# EAGLE design untitled 3 (EAGLE 7.5.0)
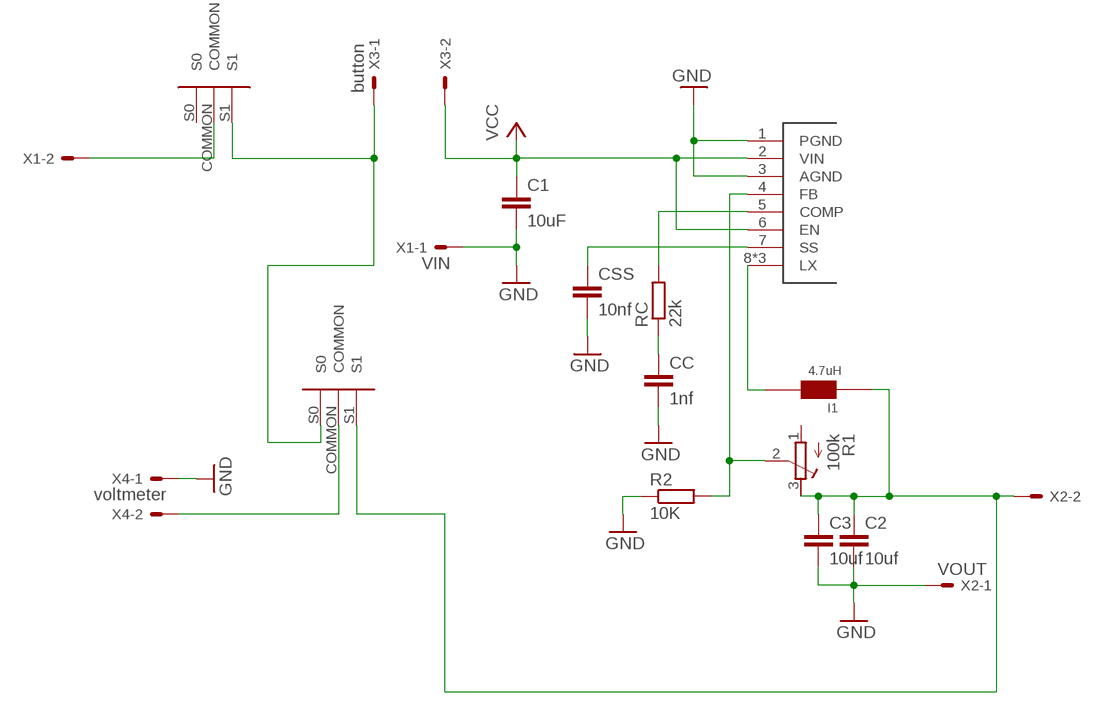
[diagram p0: schematic, sheet 1]

## Parts
C1  10uF  C-EUC0805K  [C0805K]
C2  10uf  C-EUC0805K  [C0805K]
C3  10uf  C-EUC0805K  [C0805K]
CC  1nf  C-EUC1206K  [C1206K]
CSS  10nf  C-EUC1206K  [C1206K]
I1  4.7uH  RH127  [RH127]
MASTER_ON  SPDT_SLIDE_SWITCH_2_PITCH  [SPDT_SLIDE_SWITCH_2_PITCH]
METER_SWITCH  SPDT_SLIDE_SWITCH_2_PITCH  [SPDT_SLIDE_SWITCH_2_PITCH]
R1  100k  R-TRIMM64W  [RTRIM64W]
R2  10K  R-EU_R1206  [R1206]
RC  22k  R-EU_R1206  [R1206]
U$3  AOZ1051PI  [AOZ1051PI]
X1  VIN  XH2.54  [XH2.54]
X2  VOUT  XH2.54  [XH2.54]
X3  button  XH2.54  [XH2.54]
X4  voltmeter  XH2.54  [XH2.54]

## Nets
GND: C1.2 C2.2 C3.2 CC.2 CSS.2 R2.1 U$3.1(PGND) U$3.3(AGND) X1.1 X2.1 X4.1
N$1: RC.2 U$3.5(COMP)
N$2: CC.1 RC.1
N$3: R1.2(S) R2.2 U$3.4(FB)
N$4: CSS.1 U$3.7(SS)
N$5: METER_SWITCH.COMMON X4.2
N$6: I1.P$1 U$3.8(LX) U$3.P$1(LX) U$3.P$2(LX)
N$7: C2.1 C3.1 I1.P$2 METER_SWITCH.S1 R1.3(E) X2.2
N$8: MASTER_ON.COMMON X1.2
N$10: MASTER_ON.S1 METER_SWITCH.S0 X3.1
VCC: C1.1 U$3.2(VIN) U$3.6(EN) X3.2
Unconnected: MASTER_ON.S0 R1.1(A)

## Library data of the parts
C1-C3 CC CSS = resistor:C-EU: CAPACITOR, European symbol
I1 = sh4dov lib:RH127
MASTER_ON METER_SWITCH = sh4dov lib:SPDT_SLIDE_SWITCH_2_PITCH
R1 = resistor:R-TRIMM: Trimm resistor
R2 RC = resistor:R-EU_: RESISTOR, European symbol
U$3 = sh4dov lib:AOZ1051PI
X1-X4 = sh4dov lib:XH2.54: .100" (2.54mm) Center Header - 2 Pin; MF: MOLEX; MPN: 22-23-2021; OC_FARNELL: 1462926; OC_NEWARK: 25C3832

## Board
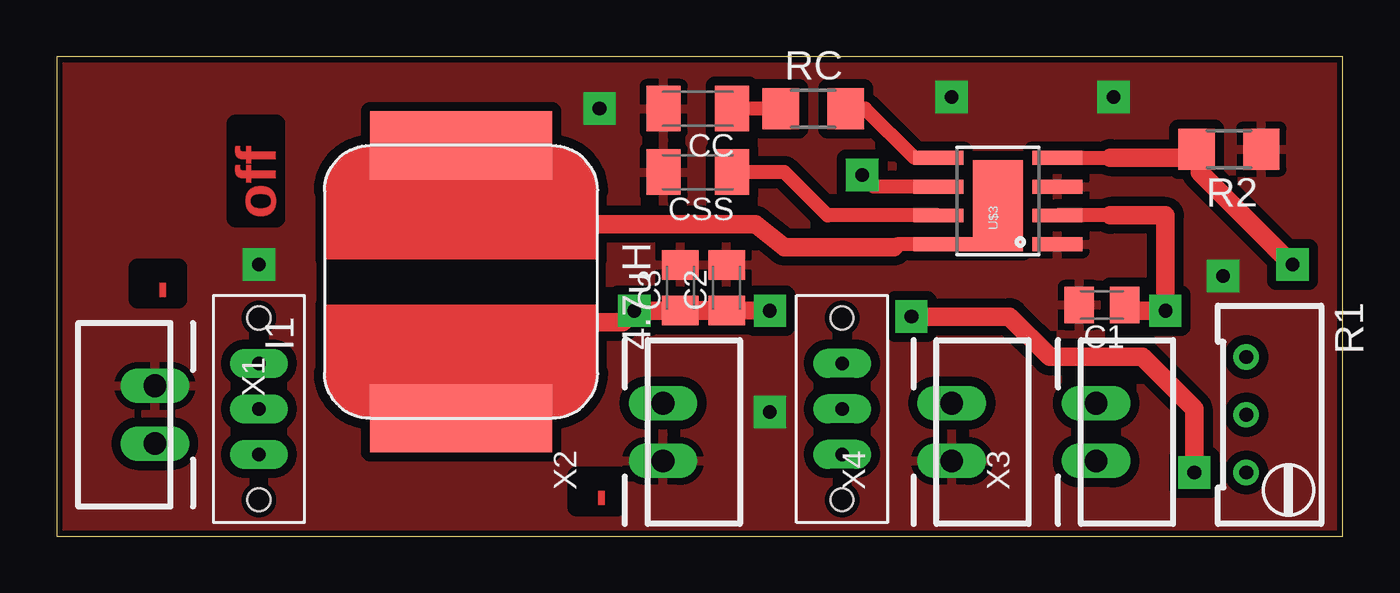
[diagram p1: board, top side]
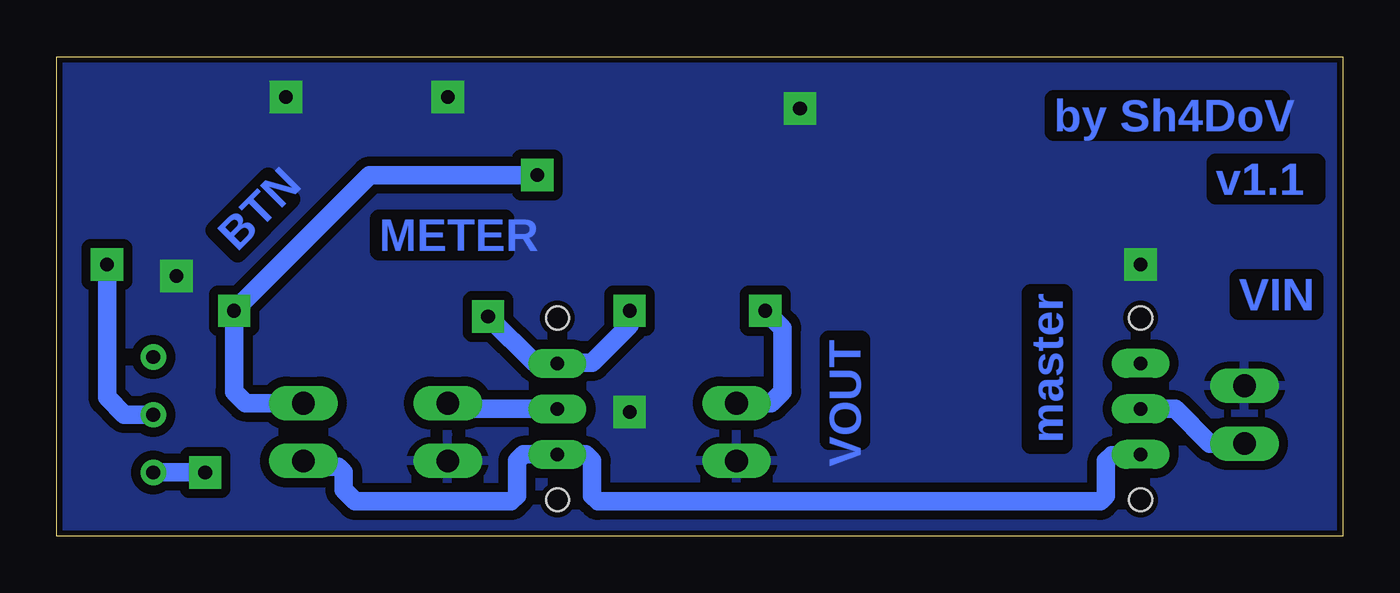
[diagram p2: board, bottom side, seen from below]

Size 56.57 x 21.07 mm. Coordinates in mm from the lower left corner, seen from the top.
Outline: 0,0 56.57,0 56.57,21.07 0,21.07 0,0
Copper layers (1*16): Top 0.035mm / dielectric 1.5mm / Bottom 0.035mm
Design rules "default 16mils": minimum track width 10mil, minimum drill 24mil, track to track 16mil, track to pad 16mil, pad to pad 16mil, via to via 16mil, smd to smd 10mil, copper to edge 10mil, drill to drill 10mil, minimum pad ring 10mil, minimum via ring 8mil, stop-mask expansion 4mil, vias tented up to drill 0mil, thermal gap 12mil

### Footprints (pad centres in the part's own frame; a part is rotated, then mirrored left to right if it is on the bottom)
C0805K = smd 1.3 x 1.6: 1 -1,0; 2 1,0
C1206K = smd 1.5 x 2: 1 -1.5,0; 2 1.5,0
RH127 = smd 8 x 3: P$1 0,6; P$2 0,-6
SPDT_SLIDE_SWITCH_2_PITCH = drill 0.6 pad 1.27 long: COMMON 0,0; S0 -2,0; S1 2,0 | hole 1: -4,0; 4,0
RTRIM64W = drill 0.61: 1 1.27,-2.54; 2 1.27,0; 3 1.27,2.54
R1206 = smd 1.6 x 1.803: 1 -1.422,0; 2 1.422,0
AOZ1051PI = smd 0.61 x 2.21: 1 -1.905,-2.616; 2 -0.635,-2.616; 3 0.635,-2.616; 4 1.905,-2.616; 5 1.905,2.616; 6 0.635,2.616; 7 -0.635,2.616; 8 -1.905,2.616 | smd 4 x 2.2: P$1 -0.2,0 | smd 0.6 x 0.6: P$2 -1.9,1.3
XH2.54 = drill 1 long: 1 -1.27,0; 2 1.27,0

### Placement (x,y rotation side)
C1  45.97,10.16 180 top
C2  29.46,10.92 90 top
C3  27.43,10.92 90 top
CC  28.19,18.8 180 top
CSS  28.19,16 180 top
I1  17.78,11.18 0 top
MASTER_ON  8.89,5.59 270 top
METER_SWITCH  34.54,5.59 90 top
R1  53.59,5.33 180 top
R2  51.56,17.02 180 top
RC  33.27,18.8 0 top
U$3  41.4,14.73 90 top
X1  4.32,5.33 270 top
X2  26.67,4.57 90 top
X3  45.72,4.57 90 top
X4  39.37,4.57 90 top

### Tracks (layer width: path | path; a pad name or v marks a point on that pad's centre or on a via)
GND  (via drill 0.6 pad 1.42)
  other vias: 23.88,18.8 8.89,11.94 31.37,5.46 51.31,11.43 39.37,19.3 46.48,19.3
  pour Bottom: 0,0 56.64,0 56.64,21.08 0,21.08
  pour Top: 0,21.08 56.64,21.08 56.64,0 0,0
N$1
  Top 0.61: U$3.5 37.72,16.64 35.56,18.8 RC.2
N$2
  Top 0.61: RC.1 CC.1
N$3  (via drill 0.6 pad 1.42)
  Top 0.61: U$3.4 46.35,16.64
  Top 0.813: v54.36,11.94 50.29,16 50.29,16.51 | 50.29,16.51 50.29,16.87 R2.2 | 46.35,16.64 50.16,16.64 50.29,16.51
  Bottom 0.813: R1.2 53.59,5.33 54.36,6.1 v54.36,11.94
N$4
  Top 0.61: CSS.1 32,16 33.91,14.1 U$3.7
N$5
  Bottom 0.813: METER_SWITCH.COMMON 39.12,5.59 X4.2
N$6
  Top 0.61: 20.83,18.03 17.88,18.03 I1.P$1 | U$3.P$1 40.64,15.04 40.64,12.95 40.52,12.83 U$3.P$2 U$3.8 36.96,12.83 36.83,12.7
  Top 0.813: 20.83,18.03 20.83,16.26 23.37,13.72 30.73,13.72 32,12.7 36.83,12.7
N$7  (via drill 0.6 pad 1.42)
  Top 0.813: I1.P$2 18.38,4.83 18.8,4.83 23.37,9.4 24.89,9.4 v25.4,9.91 28.69,9.91 C2.1 | C3.1 C2.1 | C2.1 29.07,9.92 v31.37,9.91 | v37.59,9.65 41.91,9.65 43.69,7.87 47.75,7.87 50.04,5.59 v50.04,2.79
  Bottom 0.813: X2.2 25.15,5.84 24.64,6.35 24.64,9.14 v25.4,9.91 | v37.59,9.65 35.53,7.59 METER_SWITCH.S1 34.51,7.62 33.02,7.62 31.37,9.27 v31.37,9.91 | v50.04,2.79 R1.3
N$8
  Bottom 0.813: X1.2 5.84,4.06 7.37,5.59 MASTER_ON.COMMON
N$9
  pour Bottom: 0,0 56.64,0 56.64,21.08 0,21.08
N$10
  Bottom 0.813: MASTER_ON.S1 8.92,3.56 10.16,3.56 10.41,3.3 10.41,1.78 10.67,1.52 32.77,1.52 33.02,1.78 33.02,3.3 33.31,3.59 METER_SWITCH.S0 36.04,3.59 36.32,3.3 36.32,1.78 36.58,1.52 43.43,1.52 43.94,2.03 43.94,2.79 44.2,3.05 45.47,3.05 X3.1
N$11
  pour Top: 0,0 56.64,0 56.64,21.08 0,21.08
VCC  (via drill 0.6 pad 1.42)
  Top 0.61: U$3.6 35.94,15.37 v35.43,15.88 | 46.35,14.1 U$3.2
  Top 0.813: 46.35,14.1 48.77,14.1 v48.77,9.91 47.23,9.91 C1.1
  Bottom 0.813: X3.2 48.26,5.84 48.77,6.35 v48.77,9.91 42.8,15.88 v35.43,15.88

### Text on the board
Top: off | - | -
Bottom: by Sh4DoV | v1.1 | METER | BTN | master | VIN | VOUT